# Altium schematic sheet SolderingStation_Control.SchDoc
size A4
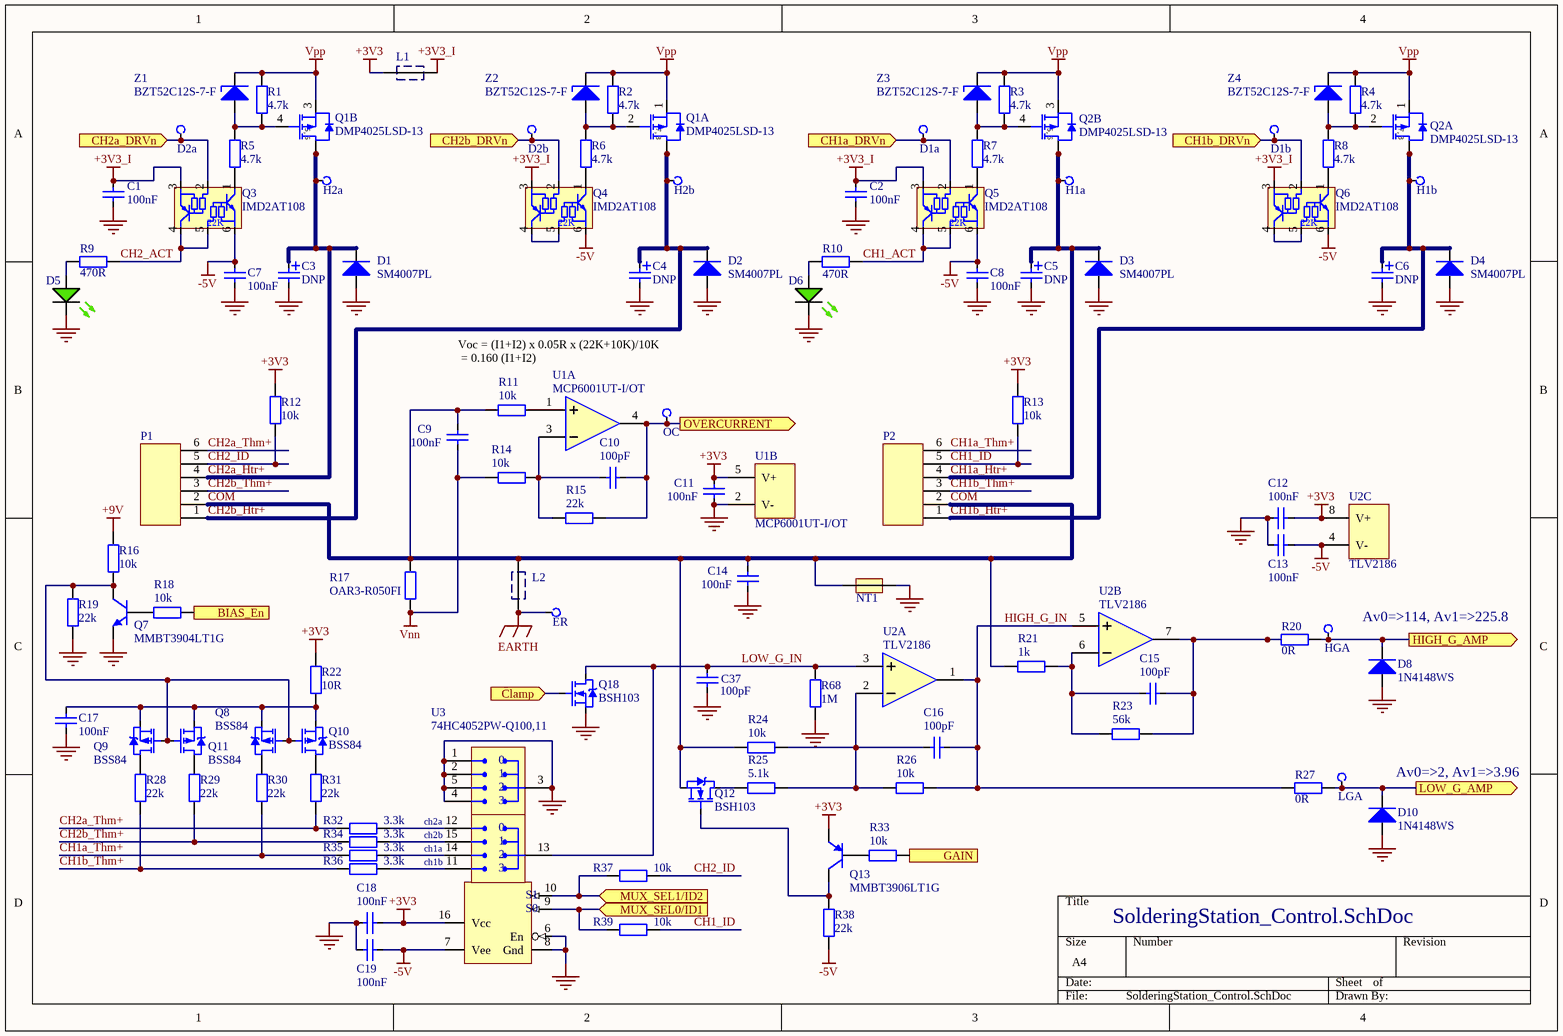
[diagram p0: SolderingStation_Control.SchDoc]

## Parts
C1  100nF  [CCNP1608-0603_N]
C2  100nF  [CCNP1608-0603_N]
C3  DNP  [CC2012-0805]  (no BOM)
C4  DNP  [CC2012-0805]  (no BOM)
C5  DNP  [CC2012-0805]  (no BOM)
C6  DNP  [CC2012-0805]  (no BOM)
C7  100nF  [CCNP1608-0603_N]
C8  100nF  [CCNP1608-0603_N]
C9  100nF  [CCNP1608-0603_N]
C10  100pF  [CCNP1608-0603_N]
C11  100nF  [CCNP1608-0603_N]
C12  100nF  [CCNP1608-0603_N]
C13  100nF  [CCNP1608-0603_N]
C14  100nF  [CCNP1608-0603_N]
C15  100pF  [CCNP1608-0603_N]
C16  100pF  [CCNP1608-0603_N]
C17  100nF  [CCNP1608-0603_N]
C18  100nF  [CCNP1608-0603_N]
C19  100nF  [CCNP1608-0603_N]
C37  100pF  [CCNP1608-0603_N]
D1  SM4007PL  [SOD-123FL]
D1a  Drive1  [PCBPIN - 0.9mm]  (value not drawn)  (no BOM)
D1b  Drive2  [PCBPIN - 0.9mm]  (value not drawn)  (no BOM)
D2  SM4007PL  [SOD-123FL]
D2a  Drive2  [PCBPIN - 0.9mm]  (value not drawn)  (no BOM)
D2b  Drive2  [PCBPIN - 0.9mm]  (value not drawn)  (no BOM)
D3  SM4007PL  [SOD-123FL]
D4  SM4007PL  [SOD-123FL]
D5  LED  [LED3MM-GREEN - 10mm Proud]  (value not drawn)
D6  LED  [LED3MM-GREEN - 10mm Proud]  (value not drawn)
D8  1N4148WS  [SOD-323]
D10  1N4148WS  [SOD-323]
ER  Gnd  [PCBPIN - 0.9mm]  (value not drawn)  (no BOM)
H1a  Heater1  [PCBPIN - 0.9mm]  (value not drawn)  (no BOM)
H1b  Heater2  [PCBPIN - 0.9mm]  (value not drawn)  (no BOM)
H2a  Heater2  [PCBPIN - 0.9mm]  (value not drawn)  (no BOM)
H2b  Heater2  [PCBPIN - 0.9mm]  (value not drawn)  (no BOM)
HGA  TC1  [PCBPIN - 0.9mm]  (value not drawn)  (no BOM)
L1  Ferrite Bead  [FB2012-0805]  (value not drawn)
L2  Ferrite Bead  [FB2012-0805]  (value not drawn)
LGA  NTC1  [PCBPIN - 0.9mm]  (value not drawn)  (no BOM)
NT1  NetTieVia  [NetTieVia]  (value not drawn)  (net tie, no BOM)
OC  Overcurrent  [PCBPIN - 0.9mm]  (value not drawn)  (no BOM)
P1  MOLEX-43045-0612  [MOLEX-43045-0612]  (value not drawn)
P2  MOLEX-43045-0612  [MOLEX-43045-0612]  (value not drawn)
Q1  DMP4025LSD-13  [SO-8_M]  (parts A,B of 2)
Q2  DMP4025LSD-13  [SO-8_M]  (parts A,B of 2)
Q3  IMD2AT108  [SOT457_N - MIRROR]
Q4  IMD2AT108  [SOT457_N - MIRROR]
Q5  IMD2AT108  [SOT457_N - MIRROR]
Q6  IMD2AT108  [SOT457_N - MIRROR]
Q7  MMBT3904LT1G  [SOT23_N]
Q8  BSS84  [SOT23_M]
Q9  BSS84  [SOT23_M]
Q10  BSS84  [SOT23_M]
Q11  BSS84  [SOT23_M]
Q12  BSH103  [SOT23_N]
Q13  MMBT3906LT1G  [SOT23_N]
Q18  BSH103  [SOT23_N]
R1  4.7k  [CR1608-0603_N]
R2  4.7k  [CR1608-0603_N]
R3  4.7k  [CR1608-0603_N]
R4  4.7k  [CR1608-0603_N]
R5  4.7k  [CR1608-0603_N]
R6  4.7k  [CR1608-0603_N]
R7  4.7k  [CR1608-0603_N]
R8  4.7k  [CR1608-0603_N]
R9  470R  [CR1608-0603_N]
R10  470R  [CR1608-0603_N]
R11  10k  [CR1608-0603_N]
R12  10k  [CR1608-0603_N]
R13  10k  [CR1608-0603_N]
R14  10k  [CR1608-0603_N]
R15  22k  [CR1608-0603_N]
R16  10k  [CR1608-0603_N]
R17  OAR3-R050FI  [OAR3-R050FI]
R18  10k  [CR1608-0603_N]
R19  22k  [CR1608-0603_N]
R20  0R  [CR1608-0603_N]
R21  1k  [CR1608-0603_N]
R22  10R  [CR1608-0603_N]
R23  56k  [CR1608-0603_N]
R24  10k  [CR1608-0603_N]
R25  5.1k  [CR1608-0603_N]
R26  10k  [CR1608-0603_N]
R27  0R  [CR1608-0603_N]
R28  22k  [CR1608-0603_N]
R29  22k  [CR1608-0603_N]
R30  22k  [CR1608-0603_N]
R31  22k  [CR1608-0603_N]
R32  3.3k  [CR1608-0603_N]
R33  10k  [CR1608-0603_N]
R34  3.3k  [CR1608-0603_N]
R35  3.3k  [CR1608-0603_N]
R36  3.3k  [CR1608-0603_N]
R37  10k  [CR1608-0603_N]
R38  22k  [CR1608-0603_N]
R39  10k  [CR1608-0603_N]
R68  1M  [CR1608-0603_N]
U1  MCP6001UT-I/OT  [SOT23-5_M]  (parts A,B of 2)
U2  TLV2186  [SOIC127P600-8M]  (parts A,B,C of 3)
U3  74HC4052PW-Q100,11  [TSSOP16_M]
Z1  BZT52C12S-7-F  [SOD-323]
Z2  BZT52C12S-7-F  [SOD-323]
Z3  BZT52C12S-7-F  [SOD-323]
Z4  BZT52C12S-7-F  [SOD-323]

## Ports
BIAS_En (in), CH1a_DRVn (in), CH1b_DRVn (in), CH2a_DRVn (in), CH2b_DRVn (in), Clamp (in), GAIN (in), HIGH_G_AMP (out), LOW_G_AMP (out), MUX_SEL0/ID1 (in), MUX_SEL1/ID2 (in), OVERCURRENT (out)

## Nets
+3V3: C11.1 C12.1 C18.1 L1.1 Q13.2(E) R12.2 R13.2 R22.1 U1.5(V+) U2.8(V+) U3.16(Vcc)
+3V3_I: C1.1 C2.1 L1.2 Q3.3(E2) Q4.3(E2) Q5.3(E2) Q6.3(E2)
+9V: R16.1
-5V: C7.1 C8.1 C13.1 C19.1 Q3.6(E1) Q4.6(E1) Q5.6(E1) Q6.6(E1) R38.1 U2.4(V-) U3.7(Vee)
EARTH: ER.1(TP) L2.1
GND: C1.2 C2.2 C3.2 C4.2 C5.2 C6.2 C7.2 C8.2 C11.2 C12.2 C13.2 C14.2 C17.1 C18.2 C19.2 C37.1 D1.A D2.A D3.A D4.A D5.K D6.K D8.A D10.A NT1.1 Q7.2(E) Q18.2(S) R19.1 R68.1 U1.2(V-) U3.1(2Y0) U3.2(2Y2) U3.3(2Z) U3.4(2Y3) U3.5(2Y1) U3.6(En) U3.8(Gnd)
Vnn: C9.2 R14.2 R17.1
Vpp: Q1.1(S1) Q1.3(S2) Q2.1(S1) Q2.3(S2) R1.2 R2.2 R3.2 R4.2 Z1.K Z2.K Z3.K Z4.K
BIAS_En: R18.2 ; port BIAS_En
CH1_ACT: Q5.4(C2) Q5.5(B1) R10.2
CH1_ID: P2.5 R13.1 R39.1
CH1a_DRVn: D1a.1(TP) Q5.2(B2) ; port CH1a_DRVn
CH1a_Htr+: C5.1 D3.K H1a.1(TP) P2.4 Q2.5(D2) Q2.6(D2)
CH1a_Thm+: P2.6 R30.1 R35.2
CH1b_DRVn: D1b.1(TP) Q6.2(B2) ; port CH1b_DRVn
CH1b_Htr+: C6.1 D4.K H1b.1(TP) P2.1 Q2.7(D1) Q2.8(D1)
CH1b_Thm+: P2.3 R28.1 R36.2
CH2_ACT: Q3.4(C2) Q3.5(B1) R9.2
CH2_ID: P1.5 R12.1 R37.1
CH2a_DRVn: D2a.1(TP) Q3.2(B2) ; port CH2a_DRVn
CH2a_Htr+: C3.1 D1.K H2a.1(TP) P1.4 Q1.5(D2) Q1.6(D2)
CH2a_Thm+: P1.6 R31.1 R32.2
CH2b_DRVn: D2b.1(TP) Q4.2(B2) ; port CH2b_DRVn
CH2b_Htr+: C4.1 D2.K H2b.1(TP) P1.1 Q1.7(D1) Q1.8(D1)
CH2b_Thm+: P1.3 R29.1 R34.2
Clamp: Q18.1(G) ; port Clamp
COM: C9.1 C14.1 L2.2 NT1.2 P1.2 P2.2 Q12.2(S) R11.2 R17.2 R21.2 R24.1
GAIN: R33.2 ; port GAIN
HIGH_G_AMP: D8.K HGA.1(TP) R20.1 ; port HIGH_G_AMP
HIGH_G_IN: C16.2 R26.2 R27.2 U2.1(A) U2.5(B+)
LOW_G_AMP: D10.K LGA.1(TP) R27.1 ; port LOW_G_AMP
LOW_G_IN: C37.2 Q18.3(D) R68.2 U2.3(A+) U3.13(1Z)
MUX_SEL0/ID1: R39.2 U3.9(S1) ; port MUX_SEL0/ID1
MUX_SEL1/ID2: R37.2 U3.10(S0) ; port MUX_SEL1/ID2
OVERCURRENT: C10.2 OC.1(TP) R15.2 U1.4(Out) ; port OVERCURRENT
NetC10_1: C10.1 R14.1 R15.1 U1.3(In-)
NetC15_1: C15.1 R21.1 R23.1 U2.6(B-)
NetC15_2: C15.2 R20.2 R23.2 U2.7
NetC16_1: C16.1 R24.2 R25.1 R26.1 U2.2(A-)
NetC17_2: C17.2 Q8.2(S) Q9.2(S) Q10.2(S) Q11.2(S) R22.2
NetD5_A: D5.A R9.1
NetD6_A: D6.A R10.1
NetQ1_2: Q1.2(G1) R2.1 R6.2 Z2.A
NetQ1_4: Q1.4(G2) R1.1 R5.2 Z1.A
NetQ2_2: Q2.2(G1) R4.1 R8.2 Z4.A
NetQ2_4: Q2.4(G2) R3.1 R7.2 Z3.A
NetQ3_1: Q3.1(C1) R5.1
NetQ4_1: Q4.1(C1) R6.1
NetQ4_4: Q4.4(C2) Q4.5(B1)
NetQ5_1: Q5.1(C1) R7.1
NetQ6_1: Q6.1(C1) R8.1
NetQ6_4: Q6.4(C2) Q6.5(B1)
NetQ7_1: Q7.1(B) R18.1
NetQ7_3: Q7.3(C) Q8.1(G) Q9.1(G) Q10.1(G) Q11.1(G) R16.2 R19.2
NetQ8_3: Q8.3(D) R30.2
NetQ9_3: Q9.3(D) R28.2
NetQ10_3: Q10.3(D) R31.2
NetQ11_3: Q11.3(D) R29.2
NetQ12_1: Q12.1(G) Q13.3(C) R38.2
NetQ12_3: Q12.3(D) R25.2
NetQ13_1: Q13.1(B) R33.1
NetR11_1: R11.1 U1.1(In+)
NetR32_1: R32.1 U3.12(1Y0)
NetR34_1: R34.1 U3.15(1Y2)
NetR35_1: R35.1 U3.14(1Y1)
NetR36_1: R36.1 U3.11(1Y3)

## Notes on the sheet
- Voc = (I1+I2) x 0.05R x (22K+10K)/10K
  = 0.160 (I1+I2)
- Av0=>114, Av1=>225.8
- (near D10) Av0=>2, Av1=>3.96
- (near U3) ch1a
- (near U3) ch2a
- (near U3) ch2b
- (near U3) ch1b
- (in symbol 74HC4052PW-Q100,11) 0
- (in symbol DMP4025LSD-13, part A) 7, 8
- (in symbol DMP4025LSD-13, part B) 5, 6
- (in symbol IMD2AT108) 22K

## Library data of the parts
C1 C2 C7-C9 C11-C14 C17-C19 = Cap_CCNP_0603_100nF: Capacitor non-polar SMT 0603; Manufacturer: Generic Components; Class: Passive; Published: 08/06/2000; Publisher: Altium Hobart Technology Centre; SubClass: Capacitor; Farnell PN: *; Digikey: *; Value: 100nF; LCSC: C14663
C3-C6 = Cap_CC_0805: Capacitor SMT 0805; Manufacturer: Generic Components; Class: Passive; Published: 08/06/2000; Publisher: Altium Hobart Technology Centre; SubClass: Capacitor; Farnell PN: *; Digikey: *; Value: DNP
C10 C15 C16 C37 = Cap_CCNP_0603_100pF: Capacitor non-polar SMT 0603; Manufacturer: Generic Components; Class: Passive; Published: 08/06/2000; Publisher: Altium Hobart Technology Centre; SubClass: Capacitor; Farnell PN: *; Digikey: *; Value: 100pF; LCSC: C14858
D1-D4 = SM4007PL: Diodes - General Purpose, 1kV 1A 1.1V 1A SOD-123FL; Class: Discrete; SubClass: Diode - Switching; Digikey: *; Farnell PN: *; LCSC: C64898
D1a D1b D2a D2b ER H1a H1b H2a H2b HGA LGA OC = TP: Test Point; Digikey: *; Farnell PN: *; LCSC: *
D5 D6 = LED_3MM_GREEN: 3mm Green LED; Manufacturer: Generic Components; Class I: Optoelectronic; Published: 8-Jun-2000; Revision: July-2002: Re-released for DXP Platform.; Publisher: Altium Limited; Class II: LED; Digikey: *; Farnell PN: *; LCSC: *
D8 D10 = 1N4148WS: Switching Diode 100V 150mA 1.25V@150mA 4ns SOD-323; Class: Discrete; SubClass: Diode - Switching; Digikey: *; Farnell PN: 2675146; LCSC: C2128
L1 L2 = Ferrite Bead 0805: Ferrite Bead SMT 0805, TDK MPZ2012S102AT, 0.15OHM, 1.5A; Farnell PN: 1669733; Digikey: *; LCSC: C1017
P1 P2 = MOLEX-43045-0612: Wire-To-Board Connector, With Polarizing Peg, 3 mm, 6 Contacts, Header, Micro-Fit 3.0 43045 Series; Farnell PN: 1012248
Q1 Q2 = DMP4025LSD-13: P-Channel dual MOSFET, 40 V, 7.6 A, 0.018 ohm, SOIC, Surface Mount; Farnell: 2543521
Q3-Q6 = IMD2AT108: Pre-Biased NPN and PNP pair, 50 V, 100 mA, 22 kohm, 22 kohm; LCSC: C509889; Farnell PN: 1680329
Q7 = MMBT3904LT1G: General Purpose Transistor, NPN Silicon, 3-Pin SOT-23, Pb-Free, Tape and Reel; Manufacturer: On Semiconductor; IC Continuous (A): 0.2; fT Min (MHz): 300; ComponentLink2Description: Datasheet; Polarity: NPN; PackageDescription: 3-Pin Small Outline Transistor, Body 2.92 x 1.3 mm, Pitch 0.95 mm; ComponentLink2URL: http://www.onsemi.cn/pub_link/Collateral/MMBT3904LT1-D.PDF; DatasheetVersion: Rev. 12; Mounting Technology: Surface Mount; PartNumber: MMBT3904LT1G; ComponentLink1URL: http://www.onsemi.com/; ComponentLink3Description: Package Specification; ComponentLink1Description: Manufacturer URL; PackageVersion: Rev. AP, 11/2009; PackageReference: SOT-23-3-318-08; Packing: Tape and Reel; ComponentLink3URL: http://www.onsemi.cn/pub_link/Collateral/318-08.PDF; RoHS: TRUE; LCSC: C20526
Q8-Q11 = BSS84: P-Channel Enhancement Mode FET -0.13 A, -50 V,  RDS(ON) = 10R at VGS = -5 V; Digikey: *; Farnell PN: *; LCSC: C8492
Q12 Q18 = BSH103: N-channel enhancement mode FET, , 30 V, 850 mA, 0.4 ohm, SOT23; PackageDescription: SOT-23; 3 Leads; Body 3.1 x 2.5 mm, inc. leads (LxW max), Alternate Lead Configuration; ComponentLink1Description: Manufacturer Link; ComponentLink1URL: http://www.zetex.com/; ComponentLink2Description: Datasheet; ComponentLink2URL: www.zetex.com/3.0/pdf/BSS138.pdf; Farnell PN: 1081307; Digikey: *; LCSC: C88711
Q13 = MMBT3906LT1G: General Purpose Transistor, PNP Silicon, 3-Pin SOT-23, Pb-Free, Tape and Reel; Manufacturer: On Semiconductor; IC Continuous (A): -0.2; fT Min (MHz): 250; PackageDescription: 3-Pin Small Outline Transistor, Body 2.92 x 1.3 mm, Pitch 0.95 mm; PartNumber: MMBT3906LT1G; Packing: Tape and Reel; ComponentLink3Description: Package Specification; Mounting Technology: Surface Mount; ComponentLink3URL: http://www.onsemi.cn/pub_link/Collateral/318-08.PDF; ComponentLink1URL: http://www.onsemi.com/; ComponentLink2URL: http://www.onsemi.cn/pub_link/Collateral/MMBT3906LT1-D.PDF; PackageReference: SOT-23-3-318-08; Polarity: PNP; ComponentLink2Description: Datasheet; PackageVersion: Rev. AP, 11/2009; RoHS: TRUE; DatasheetVersion: Rev. 11; ComponentLink1Description: Manufacturer URL; LCSC: C53444
R1-R8 = Res_CR0603_4k7: Resistor SMT 0603; Manufacturer: Generic Components; Class: Passive; Published: 08/06/2000; Publisher: Altium Hobart Technology Centre; SubClass: Resistor; Farnell PN: *; Digikey: *; LCSC: C23162; Value: 4.7k
R9 R10 = Res_CR0603_470R: Resistor SMT 0603; Manufacturer: Generic Components; Class: Passive; Published: 08/06/2000; Publisher: Altium Hobart Technology Centre; SubClass: Resistor; Farnell PN: *; Digikey: *; Value: 470R; LCSC: C23179
R11-R14 R16 R18 R24 R26 R33 R37 R39 = Res_CR0603_10k: Resistor SMT 0603; Manufacturer: Generic Components; Class: Passive; Published: 08/06/2000; Publisher: Altium Hobart Technology Centre; SubClass: Resistor; Farnell PN: *; Digikey: *; Value: 10k; LCSC: C25804
R15 R19 R28-R31 R38 = Res_CR0603_22k: Resistor SMT 0603; Manufacturer: Generic Components; Class: Passive; Published: 08/06/2000; Publisher: Altium Hobart Technology Centre; SubClass: Resistor; Farnell PN: *; Digikey: *; LCSC: C31850; Value: 22k
R17 = OAR3-R050FI: Current Sense Resistor, 0.05 ohm, OAR Series, 3 W, Metal Strip, Radial Leaded, 1%
R20 R27 = Res_CR0603_0R: Resistor SMT 0603; Manufacturer: Generic Components; Class: Passive; Published: 08/06/2000; Publisher: Altium Hobart Technology Centre; SubClass: Resistor; Farnell PN: *; Digikey: *; LCSC: C21189; Value: 0R
R21 = Res_CR0603_1k: Resistor SMT 0603; Manufacturer: Generic Components; Class: Passive; Published: 08/06/2000; Publisher: Altium Hobart Technology Centre; SubClass: Resistor; Farnell PN: *; Digikey: *; LCSC: C21190; Value: 1k
R22 = Res_CR0603_10R: Resistor SMT 0603; Manufacturer: Generic Components; Class: Passive; Published: 08/06/2000; Publisher: Altium Hobart Technology Centre; SubClass: Resistor; Farnell PN: *; Digikey: *; Value: 10R; LCSC: C22978
R23 = Res_CR0603_56k: Resistor SMT 0603; Manufacturer: Generic Components; Class: Passive; Published: 08/06/2000; Publisher: Altium Hobart Technology Centre; SubClass: Resistor; Farnell PN: *; Digikey: *; LCSC: C23206; Value: 56k
R25 = Res_CR0603_5k1: Resistor SMT 0603; Manufacturer: Generic Components; Class: Passive; Published: 08/06/2000; Publisher: Altium Hobart Technology Centre; SubClass: Resistor; Farnell PN: *; Digikey: *; LCSC: C23186; Value: 5.1k
R32 R34-R36 = Res_CR0603_3k3: Resistor SMT 0603; Manufacturer: Generic Components; Class: Passive; Published: 08/06/2000; Publisher: Altium Hobart Technology Centre; SubClass: Resistor; Farnell PN: *; Digikey: *; LCSC: C22978; Value: 3.3k
R68 = Res_CR0603_1M: Resistor SMT 0603; Manufacturer: Generic Components; Class: Passive; Published: 08/06/2000; Publisher: Altium Hobart Technology Centre; SubClass: Resistor; Farnell PN: *; Digikey: *; LCSC: C25804; Value: 1M
U1 = MCP6001UT-I/OT: Op-Amp, Single supply R-R in/out; Digikey: *; Farnell PN: *; LCSC: C21403
U2 = TLV2186: Dual Precision,Rail-to-Rail Input and Output, 4.5-24V, Zero-Drift OperationalAmplifier
U3 = 74HC4052PW-Q100,11: Analog Multiplexer / Demultiplexer, 4:1, 2 Circuits, 225 ohm, 2V to 10V, TSSOP-16; Farnell PN: 2445305; LCSC: C547006
Z1-Z4 = BZT52C12S-7-F: Surface Mount Zener Diode, 12-13 V, -65 to 150 degC, SOD-123; LCSC: C124208
NT1 = NetTieVia: LCSC: *